# EAGLE schematic box_board (EAGLE 8.2.0)
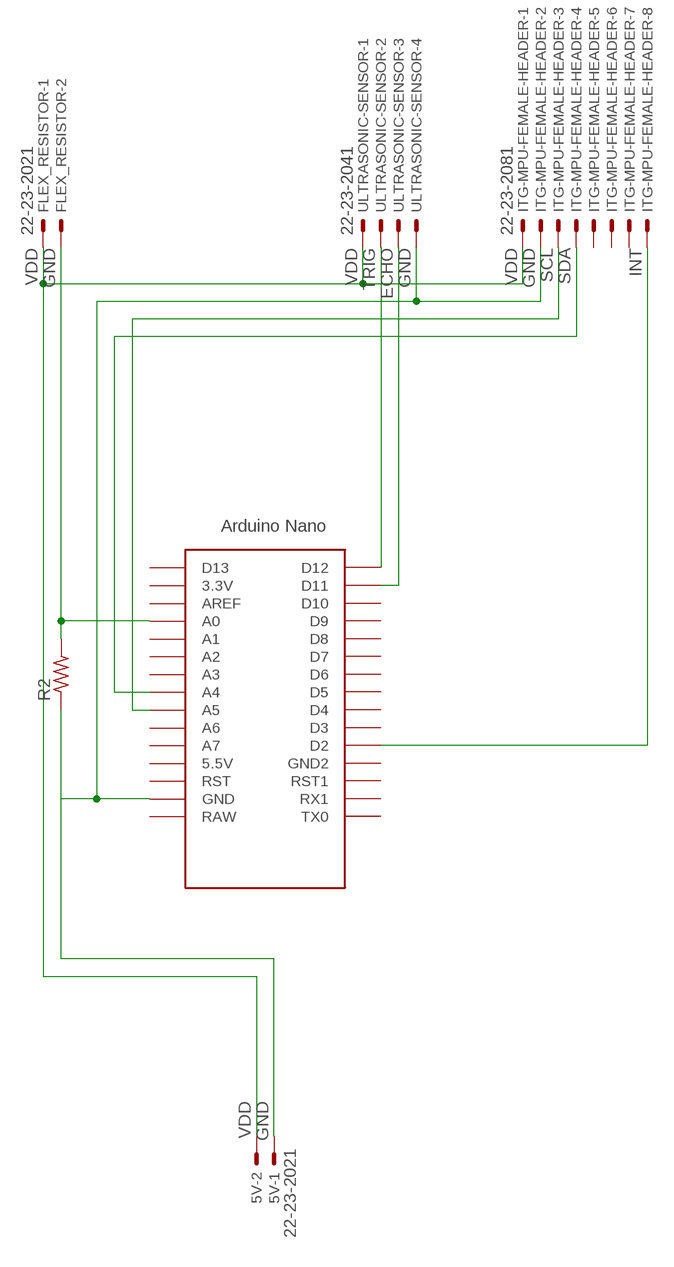
[diagram p0: schematic, sheet 1]

## Parts
5V  22-23-2021  [22-23-2021]
FLEX_RESISTOR  22-23-2021  [22-23-2021]
ITG-MPU-FEMALE-HEADER  22-23-2081  [22-23-2081]
R2  R-US_0204/7  [0204/7]
U$1  NANO  [NANO]
ULTRASONIC-SENSOR  22-23-2041  [22-23-2041]

## Nets
ECHO: U$1.D11 ULTRASONIC-SENSOR.3
GND: 5V.1 FLEX_RESISTOR.2 ITG-MPU-FEMALE-HEADER.2 R2.1 R2.2 U$1.A0 U$1.GND ULTRASONIC-SENSOR.4
INT: ITG-MPU-FEMALE-HEADER.8 U$1.D2
SCL: ITG-MPU-FEMALE-HEADER.3 U$1.A5
SDA: ITG-MPU-FEMALE-HEADER.4 U$1.A4
TRIG: U$1.D12 ULTRASONIC-SENSOR.2
VDD: 5V.2 FLEX_RESISTOR.1 ITG-MPU-FEMALE-HEADER.1 ULTRASONIC-SENSOR.1
Unconnected: ITG-MPU-FEMALE-HEADER.5 ITG-MPU-FEMALE-HEADER.6 ITG-MPU-FEMALE-HEADER.7 U$1.3.3V U$1.5V(5.5V) U$1.A1 U$1.A2 U$1.A3 U$1.A6 U$1.A7 U$1.AREF U$1.D3 U$1.D4 U$1.D5 U$1.D6 U$1.D7 U$1.D8 U$1.D9 U$1.D10 U$1.D13 U$1.GND1(GND2) U$1.ICSP1 U$1.ICSP2 U$1.ICSP3 U$1.ICSP4 U$1.ICSP5 U$1.ICSP6 U$1.RAW U$1.RST U$1.RST1 U$1.RX1 U$1.TX0

## Library data of the parts
5V FLEX_RESISTOR = con-molex:22-23-2021: .100" (2.54mm) Center Header - 2 Pin; MF: MOLEX; MPN: 22-23-2021; OC_FARNELL: 1462926; OC_NEWARK: 25C3832
ITG-MPU-FEMALE-HEADER = con-molex:22-23-2081: .100" (2.54mm) Center Header - 8 Pin; MF: MOLEX; MPN: 22-23-2081; OC_FARNELL: 1756826; OC_NEWARK: 01C7592
R2 = adafruit:R-US_: RESISTOR, American symbol
U$1 = Arduino-clone:NANO: Arduino Nano
ULTRASONIC-SENSOR = con-molex:22-23-2041: .100" (2.54mm) Center Header - 4 Pin; MF: MOLEX; MPN: 22-23-2041; OC_FARNELL: 1462920; OC_NEWARK: 38C0355